# Altium schematic sheet main.SchDoc
size 209 x 148 mm
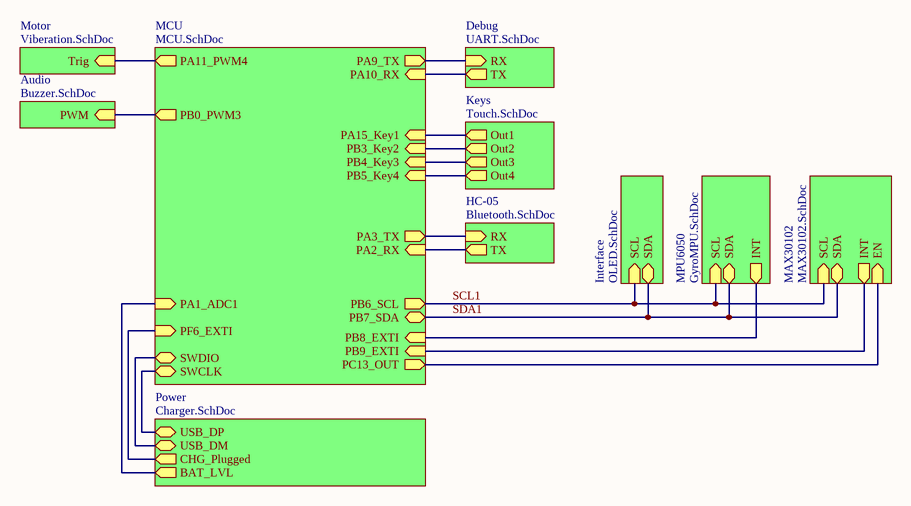
[diagram p0: main.SchDoc]

## Sub-sheets
Audio = Buzzer.SchDoc: PWM (in)
Debug = UART.SchDoc: RX (in), TX (out)
HC-05 = Bluetooth.SchDoc: RX (in), TX (out)
Interface = OLED.SchDoc: SDA (bidir), SCL (in)
Keys = Touch.SchDoc: Out4 (out), Out2 (out), Out1 (out), Out3 (out)
MAX30102 = MAX30102.SchDoc: SCL (in), INT (out), SDA (bidir), EN (in)
MCU = MCU.SchDoc: PA2_RX (in), PB7_SDA (bidir), SWDIO (bidir), SWCLK (bidir), PA9_TX (out), PA3_TX (out), PA10_RX (in), PB6_SCL (out), PA11_PWM4 (out), PA1_ADC1 (in), PF6_EXTI (in), PB4_Key3 (in), PB3_Key2 (in), PB8_EXTI (in), PA15_Key1 (in), PB5_Key4 (in), PB0_PWM3 (out), PB9_EXTI (in), PC13_OUT (out)
Motor = Viberation.SchDoc: Trig (in)
MPU6050 = GyroMPU.SchDoc: INT (out), SDA (bidir), SCL (in)
Power = Charger.SchDoc: CHG_Plugged (out), USB_DP (bidir), BAT_LVL (out), USB_DM (bidir)

## Nets
SCL1: sheet MCU/PB6_SCL, sheet Interface/SCL, sheet MPU6050/SCL, sheet MAX30102/SCL
SDA1: sheet MCU/PB7_SDA, sheet Interface/SDA, sheet MPU6050/SDA, sheet MAX30102/SDA
(unnamed): sheet MCU/PA2_RX, sheet HC-05/TX
(unnamed): sheet MCU/SWDIO, sheet Power/USB_DM
(unnamed): sheet MCU/SWCLK, sheet Power/USB_DP
(unnamed): sheet MCU/PA9_TX, sheet Debug/RX
(unnamed): sheet MCU/PA3_TX, sheet HC-05/RX
(unnamed): sheet MCU/PA10_RX, sheet Debug/TX
(unnamed): sheet MCU/PA11_PWM4, sheet Motor/Trig
(unnamed): sheet MCU/PA1_ADC1, sheet Power/BAT_LVL
(unnamed): sheet MCU/PF6_EXTI, sheet Power/CHG_Plugged
(unnamed): sheet MCU/PB4_Key3, sheet Keys/Out3
(unnamed): sheet MCU/PB3_Key2, sheet Keys/Out2
(unnamed): sheet MCU/PB8_EXTI, sheet MPU6050/INT
(unnamed): sheet MCU/PA15_Key1, sheet Keys/Out1
(unnamed): sheet MCU/PB5_Key4, sheet Keys/Out4
(unnamed): sheet MCU/PB0_PWM3, sheet Audio/PWM
(unnamed): sheet MCU/PB9_EXTI, sheet MAX30102/INT
(unnamed): sheet MCU/PC13_OUT, sheet MAX30102/EN